# EAGLE design mag_encoder_Rev3_single_sided_1 (EAGLE 7.5.0)
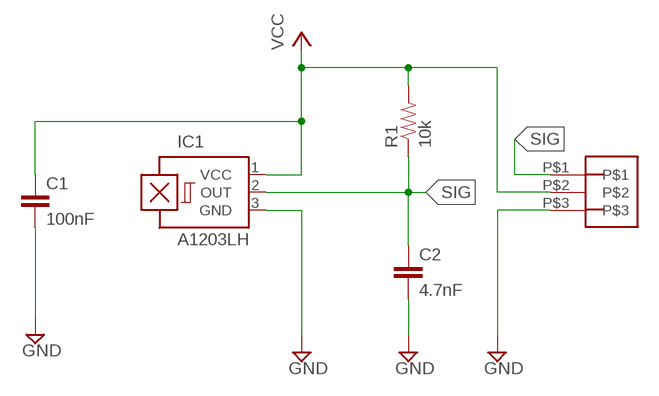
[diagram p0: schematic, sheet 1]

## Parts
C1  100nF  CAP0603-CAP  [0603-CAP]
C2  4.7nF  4.7NF-50V-10%(0603)  [0603-CAP]
IC1  A1203LH  [SOT23-W]
R1  10k  10.5KOHM1/10W1%(0603)  [0603]
U$1  3_PIN_JST-XH  [3_PIN_JST-XH]

## Nets
GND: C1.2 C2.2 IC1.3(GND) U$1.P$3
SIG: C2.1 IC1.2(OUT) R1.1 U$1.P$1
VCC: C1.1 IC1.1(VCC) R1.2 U$1.P$2

## Library data of the parts
C1 = SparkFun-Capacitors:CAP: Capacitor Standard 0603 ceramic capacitor, and 0.1" leaded capacitor.
C2 = SparkFun-Capacitors:4.7NF-50V-10%(0603): CAP-11378; PROD_ID: CAP-11378
IC1 = allegro:A12*?: Hall-effect bipolar switch Source: http://www.allegromicro.com/en/Products/Part_Numbers/1202/1202.pdf; MF: ALLEGRO MICROSYSTEMS, INC.; MPN: A1203LLHLT-T; OC_FARNELL: 1791384; OC_NEWARK: 31K6608
R1 = SparkFun-Resistors:10.5KOHM1/10W1%(0603): RES-09570; PROD_ID: RES-09570; VALUE: 10.5k
U$1 = Clayton:3_PIN_JST-XH: 3-pin JST XH Shrouded Header, top entry, 2.5 mm pitch

## Board
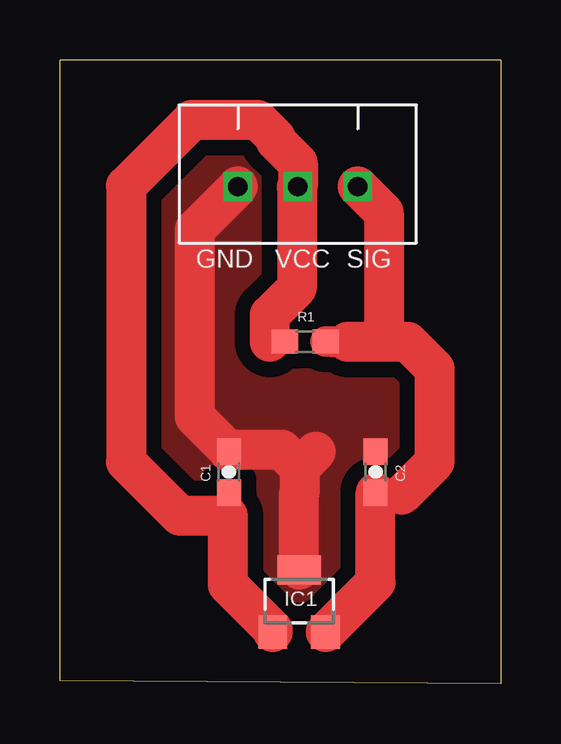
[diagram p1: board, top side]

Size 18.38 x 26 mm. Coordinates in mm from the lower left corner, seen from the top.
Outline: 0,0.12 0,26 18.38,26 18.38,0 0,0.12
Copper layers 1: Top 0.0356mm
Design rules "LawlorPCB": minimum track width 25mil, minimum drill 13mil, track to track 25mil, track to pad 25mil, pad to pad 10mil, via to via 10mil, smd to smd 10mil, copper to edge 15mil, drill to drill 15mil, minimum pad ring 7mil, minimum via ring 7mil, stop-mask expansion 3mil, vias tented up to drill 0mil, thermal gap 10mil

### Footprints (pad centres in the part's own frame; a part is rotated, then mirrored left to right if it is on the bottom)
0603-CAP = smd 1.1 x 1: 1 -0.85,0; 2 0.85,0
SOT23-W = smd 1.2 x 1.4: 1 -1.1,-1.3; 2 1.1,-1.3 | smd 1.8 x 1.2: 3 0,1.3
0603 = smd 1.1 x 1: 1 -0.85,0; 2 0.85,0
3_PIN_JST-XH = drill 0.8 square: P$1 2.45,3.4; P$2 4.95,3.4; P$3 7.45,3.4

### Placement (x,y rotation side)
C1  7.04,8.81 90 top
C2  13.16,8.81 90 top
IC1  9.98,3.44 0 top
R1  10.23,14.26 180 top
U$1  14.87,24.12 180 top

### Tracks (layer width: path | path; a pad name or v marks a point on that pad's centre or on a via)
GND
  Top 1.676: IC1.3 9.98,7.98 10,8 10,9 | 10,9 9.25,9.75 7.13,9.75 | 7.13,9.75 C1.2 | 10.66,9.66 10,9 | 7.13,9.75 7,9.75 5.62,11.12 5.62,18.93 U$1.P$3
  pour Top (no thermals): -0.88,29.5 20.25,29.5 20.25,-1.12 -0.5,-1.12
SIG
  Top 1.016: 12,14.25 11.99,14.26 R1.1 | C2.1 13.25,7.88 14.25,7.88
  Top 1.27: R1.1 11.37,14.26 11.38,14.25
  Top 1.676: IC1.2 13.16,4.22 C2.1 | U$1.P$1 13.5,19.64 13.5,14.62 13.12,14.25 | 13.12,14.25 12,14.25 | 14.25,7.88 15.62,9.25 15.62,13.12 14.5,14.25 13.12,14.25
VCC
  Top 1.016: C1.1 7.04,7.04 7,7 | R1.2 8.75,14.25
  Top 1.676: 8.75,14.25 8.75,15.38 9.88,16.5 9.88,20.68 U$1.P$2 9.92,21.71 9,22.62 9,22.75 8.25,23.5 5.5,23.5 2.75,20.75 2.75,9.25 5,7 7,7 7,4.12 8.88,2.25 IC1.1

### Text on the board
tNames: GND | VCC | SIG
bNames: Magnetic Encoder Rev3